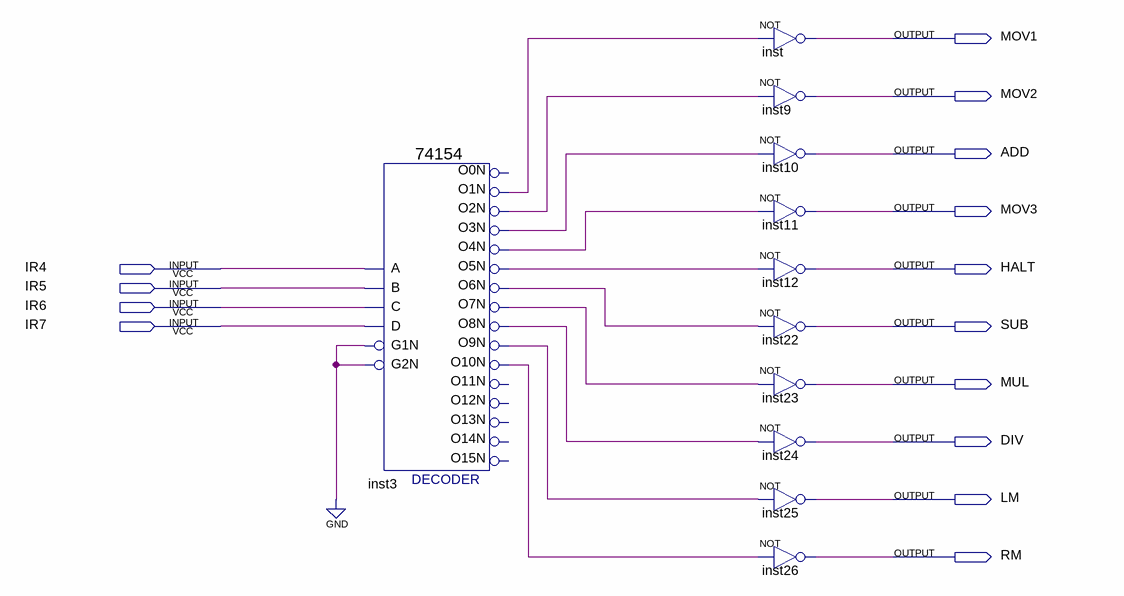
[diagram p0: schematic sheet]
// Quartus schematic OP_DECODER.bdf as structural Verilog: 11 symbols, 14 pins
module OP_DECODER (
  input  IR4,
  input  IR5,
  input  IR6,
  input  IR7,
  output MOV1,
  output MOV2,
  output ADD,
  output MOV3,
  output HALT,
  output SUB,
  output MUL,
  output DIV,
  output LM,
  output RM
);

  wire inst3_o1n, inst3_o2n, inst3_o3n, inst3_o4n, inst3_o5n, inst3_o6n, inst3_o7n, inst3_o8n, inst3_o9n,
       inst3_o10n;

  \74154  inst3 (
    .C(IR6), .D(IR7), .B(IR5), .A(IR4), .G1N(1'b0), .G2N(1'b0), .O10N(inst3_o10n), .O1N(inst3_o1n),
    .O4N(inst3_o4n), .O3N(inst3_o3n), .O2N(inst3_o2n), .O7N(inst3_o7n), .O6N(inst3_o6n), .O5N(inst3_o5n),
    .O9N(inst3_o9n), .O8N(inst3_o8n));  // open: O0N, O12N, O15N, O11N, O13N, O14N
  not inst (MOV1, inst3_o1n);
  not inst9 (MOV2, inst3_o2n);
  not inst10 (ADD, inst3_o3n);
  not inst11 (MOV3, inst3_o4n);
  not inst12 (HALT, inst3_o5n);
  not inst22 (SUB, inst3_o6n);
  not inst23 (MUL, inst3_o7n);
  not inst24 (DIV, inst3_o8n);
  not inst25 (LM, inst3_o9n);
  not inst26 (RM, inst3_o10n);
endmodule
